# Altium schematic sheet ISO.SchDoc
size A4
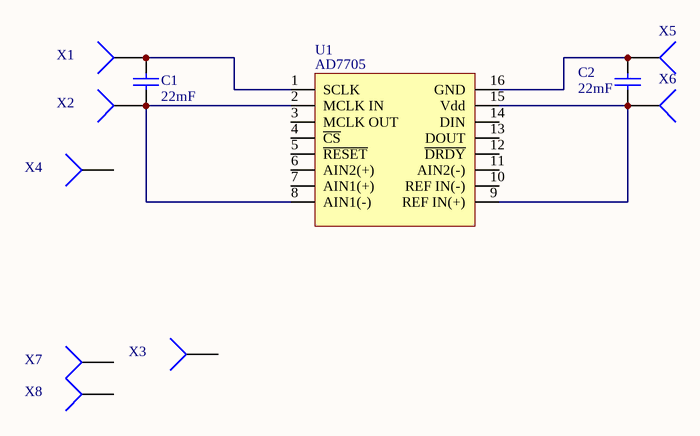
[diagram p0: ISO.SchDoc]

## Parts
C1  22mF  [C3216-1206]
C2  22mF  [C3216-1206]
U1  AD7705  [SO-G16/D10.4]
X1  (no value)  [PIN1]
X2  (no value)  [PIN1]
X3  (no value)  [PIN1]
X4  (no value)  [PIN1]
X5  (no value)  [PIN1]
X6  (no value)  [PIN1]
X7  (no value)  [PIN1]
X8  (no value)  [PIN1]

## Nets
NetC1_1: C1.1 U1.2(MCLK_IN) U1.8(AIN1(-)) X2.1
NetC1_2: C1.2 U1.1(SCLK) X1.1
NetC2_1: C2.1 U1.9(REF_IN(+)) U1.15(Vdd) X6.1
NetC2_2: C2.2 U1.16(GND) X5.1

Not connected (* = marked no-connect by the designer): U1 3(MCLK_OUT) 4(~{CS}) 5(~{RESET}) 6(AIN2(+)) 7(AIN1(+)) 10(REF_IN(-)) 11(AIN2(-)) 12(~{DRDY}) 13(DOUT) 14(DIN); X3 1; X4 1; X7 1; X8 1

## Library data of the parts
C1 C2 = Cap Semi: Capacitor (Semiconductor SIM Model); Manufacturer: Generic Components; Class I: Passive; Value: 1,0; Published: 8-Jun-2000; Revision: July-2002: Re-released for DXP Platform.; Publisher: Altium Limited; Class II: Capacitor
U1 = AD7705: ADC; Value: AD7705
X1-X8 = Socket: Manufacturer: Generic Components; Class I: Connector; Revision: July-2002: Re-released for DXP Platform.; Publisher: Altium Limited